# EAGLE design KeyboardController_r3 (EAGLE 7.7.0)

## Sheet 1 of 3
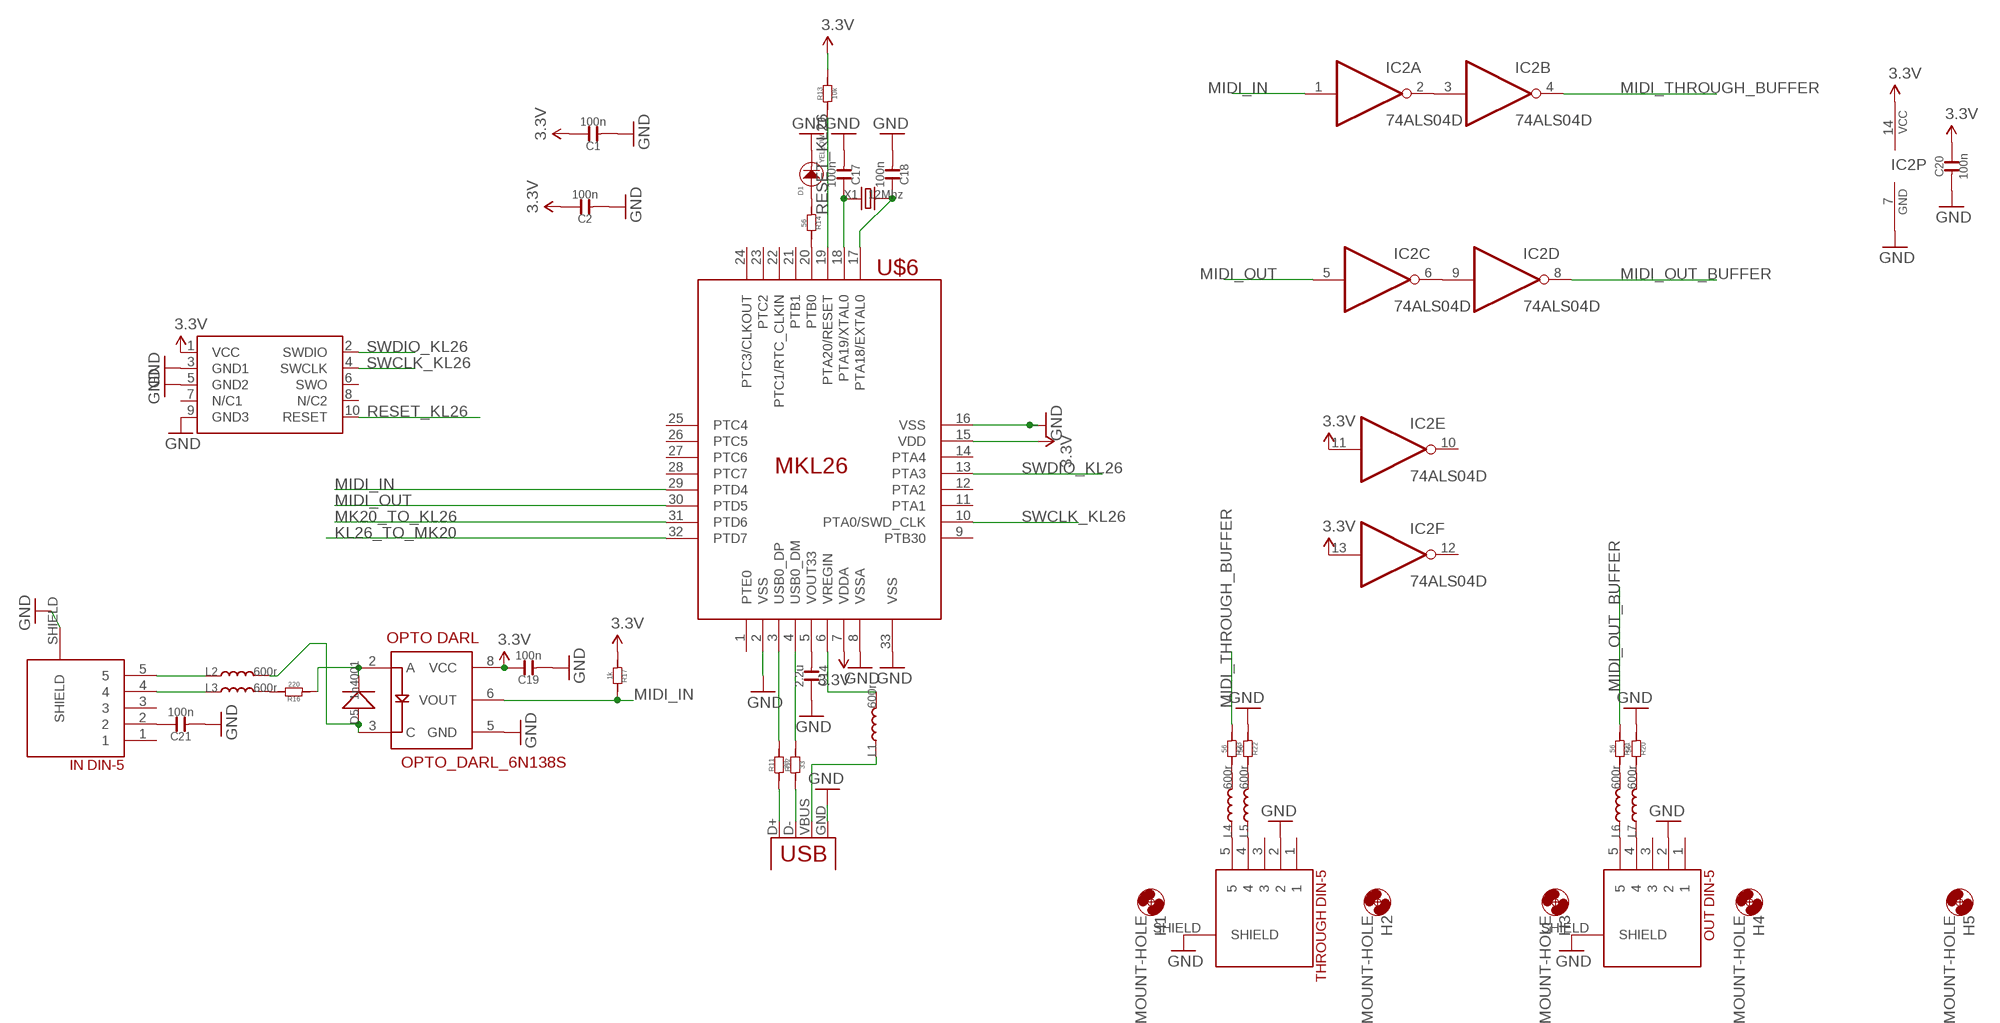
[diagram p0: schematic, sheet 1]

### Parts
C1  100n  C-0603  [C0603]
C2  100n  C-0603  [C0603]
C14  2.2u  C-0603  [C0603]
C17  100n  C-0603  [C0603]
C18  100n  C-0603  [C0603]
C19  100n  C-0603  [C0603]
C20  100n  C-0603  [C0603]
C21  100n  C-0603  [C0603]
D1  YELLOW  LED  [LED0603]
D5  1n4001  D-SOD-123  [SOD123]
H1  MOUNT-HOLE  [3.2-NOMARKINGS-SMALLSAFEZONE]
H2  MOUNT-HOLE  [3.2-NOMARKINGS-SMALLSAFEZONE]
H3  MOUNT-HOLE  [3.2-NOMARKINGS-SMALLSAFEZONE]
H4  MOUNT-HOLE  [3.2-NOMARKINGS-SMALLSAFEZONE]
H5  MOUNT-HOLE  [3.2-NOMARKINGS-SMALLSAFEZONE]
IC2  74ALS04D  [SO14]
IN  DIN-5  [DIN-5-VERTICAL]
L1  600r  L-0603  [L0603]
L2  600r  L-0603  [L0603]
L3  600r  L-0603  [L0603]
L4  600r  L-0603  [L0603]
L5  600r  L-0603  [L0603]
L6  600r  L-0603  [L0603]
L7  600r  L-0603  [L0603]
OUT  DIN-5  [DIN-5-VERTICAL]
R11  33  R-0603  [R0603]
R12  33  R-0603  [R0603]
R13  10k  R-0603  [R0603]
R14  56  R-0603  [R0603]
R16  220  R-0603  [R0603]
R17  1k  R-0603  [R0603]
R20  56  R-0603  [R0603]
R21  56  R-0603  [R0603]
R22  56  R-0603  [R0603]
R23  56  R-0603  [R0603]
SWD2  CORTEX_SWD  [M50-3600542]
THROUGH  DIN-5  [DIN-5-VERTICAL]
U$6  MKL26  [QFN50P500X500X90-33N]
U$9  OPTO_DARL_6N138S  [8-SMD]
USB  USBVERTICAL_CENTERED  [USB-B-PTH-VERTICAL-CENTERED]
X1  12Mhz  CRYSTAL-0500290P1  [2P-SMD-5.0X3.2]

### Nets
3.3V [heavypower]: C1.2 C2.2 C19.2 C20.2 IC2.11(E:I) IC2.13(F:I) IC2.14(P:VCC) R13.2 R17.1 SWD2.1(VCC) U$6.7(VDDA) U$6.15(VDD) U$9.8(VCC) ; also sheet 2,3
GND [groundplane]: C1.1 C2.1 C14.2 C17.1 C18.1 C19.1 C20.1 C21.1 D1.- IC2.7(P:GND) IN.SHIELD OUT.2 OUT.SHIELD R20.1 R22.1 SWD2.3(GND1) SWD2.5(GND2) SWD2.9(GND3) THROUGH.2 THROUGH.SHIELD U$6.2(VSS) U$6.8(VSSA) U$6.16(VSS) U$6.33(VSS) U$9.5(GND) USB.GND ; also sheet 2,3
KL26_TO_MK20: U$6.32(PTD7) ; also sheet 2
MIDI_IN: IC2.1(A:I) R17.2 U$6.29(PTD4) U$9.6(VOUT)
MIDI_OUT: IC2.5(C:I) U$6.30(PTD5)
MIDI_OUT_BUFFER: IC2.8(D:O) R21.1
MIDI_THROUGH_BUFFER: IC2.4(B:O) R23.1
MK20_TO_KL26: U$6.31(PTD6) ; also sheet 2
N$2: R11.2 U$6.3(USB0_DP)
N$3: R12.2 U$6.4(USB0_DM)
N$5: R14.2 U$6.20(PTB0)
N$6: D1.+ R14.1
N$9: C14.1 U$6.5(VOUT33)
N$10: R11.1 USB.D+
N$11: R12.1 USB.D-
N$12: L1.1 USB.VBUS
N$13: L1.2 U$6.6(VREGIN)
N$21: C17.2 U$6.18(PTA19/XTAL0) X1.1
N$26: C18.2 U$6.17(PTA18/EXTAL0) X1.2
N$28: IN.5 L2.1
N$29: IN.4 L3.1
N$30: L4.1 THROUGH.5
N$31: L5.1 THROUGH.4
N$32: L6.1 OUT.5
N$33: L7.1 OUT.4
N$34: D5.- R16.1 U$9.2(A)
N$35: D5.+ L2.2 U$9.3(C)
N$36: L3.2 R16.2
N$37: IC2.2(A:O) IC2.3(B:I)
N$38: IC2.6(C:O) IC2.9(D:I)
N$39: C21.2 IN.2
N$41: L7.2 R20.2
N$42: L6.2 R21.2
N$43: L5.2 R22.2
N$44: L4.2 R23.2
RESET_KL26: R13.1 SWD2.10(RESET) U$6.19(PTA20/RESET)
SWCLK_KL26: SWD2.4(SWCLK) U$6.10(PTA0/SWD_CLK)
SWDIO_KL26: SWD2.2(SWDIO) U$6.13(PTA3)
Unconnected: IC2.10(E:O) IC2.12(F:O) IN.1 IN.3 OUT.1 OUT.3 SWD2.6(SWO) SWD2.7(N/C1) SWD2.8(N/C2) THROUGH.1 THROUGH.3 U$6.1(PTE0) U$6.9(PTB30) U$6.11(PTA1) U$6.12(PTA2) U$6.14(PTA4) U$6.21(PTB1) U$6.22(PTC1/RTC_CLKIN) U$6.23(PTC2) U$6.24(PTC3/CLKOUT) U$6.25(PTC4) U$6.26(PTC5) U$6.27(PTC6) U$6.28(PTC7)

## Sheet 2 of 3
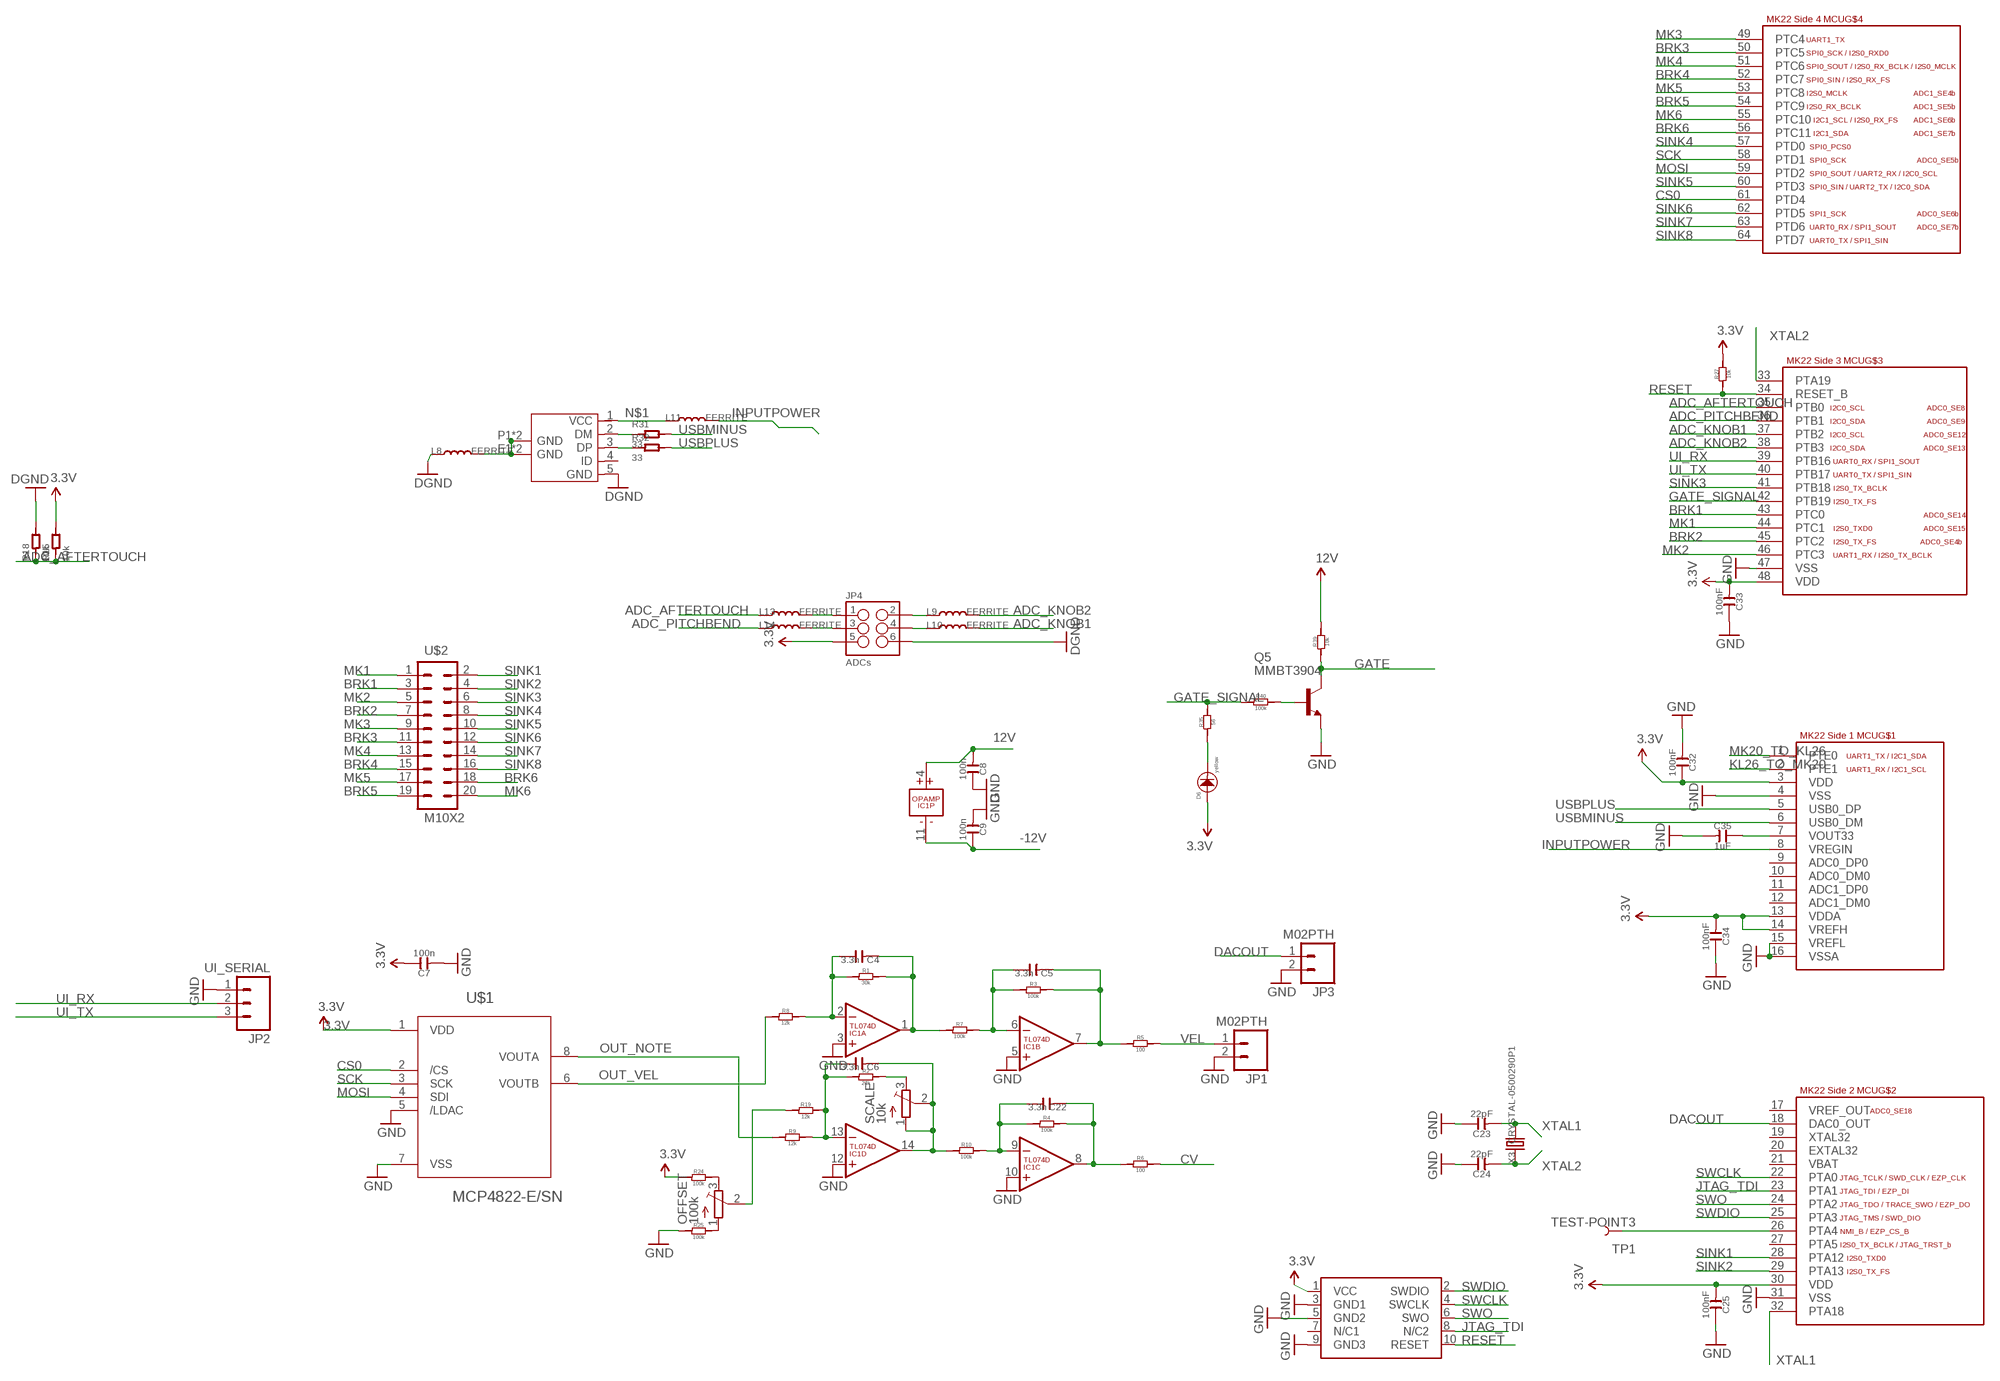
[diagram p1: schematic, sheet 2]

### Parts
C4  3.3n  C-0603  [C0603]
C5  3.3n  C-0603  [C0603]
C6  3.3n  C-0603  [C0603]
C7  100n  C-0603  [C0603]
C8  100n  C-0603  [C0603]
C9  100n  C-0603  [C0603]
C22  3.3n  C-0603  [C0603]
C23  22pF  C-0603  [C0603]
C24  22pF  C-0603  [C0603]
C25  100nF  C-0603  [C0603]
C32  100nF  C-0603  [C0603]
C33  100nF  C-0603  [C0603]
C34  100nF  C-0603  [C0603]
C35  1uF  C-0603  [C0603]
D6  yellow  LED  [LED0603]
IC1  TL074D  [SO14]
J2  MICRO-USB-5P-340015001  [B-SMD-5P]
JP1  M02PTH  [1X02]
JP2  UI_SERIAL  M03PTH  [1X03]
JP3  M02PTH  [1X02]
JP4  ADCs  M03X2  [2X3-SHROUDED]
L8  FERRITE  L-0603  [L0603]
L9  FERRITE  L-0603  [L0603]
L10  FERRITE  L-0603  [L0603]
L11  FERRITE  L-0603  [L0603]
L13  FERRITE  L-0603  [L0603]
L14  FERRITE  L-0603  [L0603]
MCU  MK22_120_TQFP64  [MK22_TQFP64]
OFFSET  100k  TRIMPOTTC33X  [TC33X]
Q5  MMBT3904  MMBT3904LT1-NPN-SOT23-BEC  [SOT23-BEC]
R1  30k  R-0603  [R0603]
R2  24k  R-0603  [R0603]
R3  100k  R-0603  [R0603]
R4  100k  R-0603  [R0603]
R5  100  R-0603  [R0603]
R6  100  R-0603  [R0603]
R7  100k  R-0603  [R0603]
R8  12k  R-0603  [R0603]
R9  12k  R-0603  [R0603]
R10  100k  R-0603  [R0603]
R15  10k  R-0603  [R0603]
R18  10k  R-0603  [R0603]
R19  12k  R-0603  [R0603]
R24  100k  R-0603  [R0603]
R25  100k  R-0603  [R0603]
R27  10k  R-0603  [R0603]
R31  33  R-0603  [R0603]
R32  33  R-0603  [R0603]
R35  56  R-0603  [R0603]
R39  10k  R-0603  [R0603]
R40  100k  R-0603  [R0603]
SCALE  10k  TRIMPOTTC33X  [TC33X]
SWD3  CORTEX_SWD  [M50-3600542]
TP1  TEST-POINT3  [PAD.03X.03]
U$1  MCP4822-E/SN  [SOIC8-N_MC]
U$2  M10X2  [2X10]
X3  CRYSTAL-0500290P1  [2P-SMD-5.0X3.2]

### Nets
3.3V [heavypower]: C7.2 C25.1 C32.2 C33.1 C34.1 D6.+ JP4.5 MCU.3(VDD) MCU.13(VDDA) MCU.14(VREFH) MCU.30(VDD) MCU.48(VDD) R15.2 R24.1 R27.2 SWD3.1(VCC) U$1.1(VDD) ; also sheet 1,3
12V [heavypower]: C8.1 IC1.4(P:V+) R39.2 ; also sheet 3
-12V [heavypower]: C9.2 IC1.11(P:V-) ; also sheet 3
ADC_AFTERTOUCH: L13.1 MCU.35(PTB0) R15.1 R18.1
ADC_KNOB1: L10.2 MCU.37(PTB2)
ADC_KNOB2: L9.2 MCU.38(PTB3)
ADC_PITCHBEND: L14.1 MCU.36(PTB1)
BRK1: MCU.43(PTC0) U$2.3
BRK2: MCU.45(PTC2) U$2.7
BRK3: MCU.50(PTC5) U$2.11
BRK4: MCU.52(PTC7) U$2.15
BRK5: MCU.54(PTC9) U$2.19
BRK6: MCU.56(PTC11) U$2.18
CS0: MCU.61(PTD4) U$1.2(/CS)
CV: R6.2 ; also sheet 3
DACOUT: JP3.1 MCU.18(DAC0_OUT)
GATE: Q5.C R39.1 ; also sheet 3
GATE_SIGNAL: MCU.42(PTB19) R35.2 R40.1
GND [groundplane]: C7.1 C8.2 C9.1 C23.2 C24.2 C25.2 C32.1 C33.2 C34.2 C35.1 IC1.3(A:+IN) IC1.5(B:+IN) IC1.10(C:+IN) IC1.12(D:+IN) J2.5(GND) JP1.2 JP2.1 JP3.2 JP4.6 L8.1 MCU.4(VSS) MCU.15(VREFL) MCU.16(VSSA) MCU.31(VSS) MCU.47(VSS) Q5.E R18.2 R25.1 SWD3.3(GND1) SWD3.5(GND2) SWD3.9(GND3) U$1.5(/LDAC) U$1.7(VSS) ; supply symbol labelled DGND ; also sheet 1,3
INPUTPOWER: L11.2 MCU.8(VREGIN)
JTAG_TDI: MCU.23(PTA1) SWD3.8(N/C2)
KL26_TO_MK20: MCU.2(PTE1) ; also sheet 1
MK1: MCU.44(PTC1) U$2.1
MK2: MCU.46(PTC3) U$2.5
MK3: MCU.49(PTC4) U$2.9
MK4: MCU.51(PTC6) U$2.13
MK5: MCU.53(PTC8) U$2.17
MK6: MCU.55(PTC10) U$2.20
MK20_TO_KL26: MCU.1(PTE0) ; also sheet 1
MOSI: MCU.59(PTD2) U$1.4(SDI)
N$1: J2.1(VCC) L11.1
N$4: R2.2 SCALE.3(E)
N$7: J2.2(DM) R31.1
N$8: J2.3(DP) R32.1
N$14: J2.E1(GND) J2.E2(GND) J2.P1(GND) J2.P2(GND) L8.2
N$17: C4.2 IC1.2(A:-IN) R1.1 R8.2
N$18: C4.1 IC1.1(A:OUT) R1.2 R7.1
N$19: C5.2 IC1.6(B:-IN) R3.1 R7.2
N$20: C5.1 IC1.7(B:OUT) R3.2 R5.1
N$22: C6.2 IC1.13(D:-IN) R2.1 R9.2 R19.2
N$23: C6.1 IC1.14(D:OUT) R10.1 SCALE.1(A) SCALE.2(S)
N$24: C22.2 IC1.9(C:-IN) R4.1 R10.2
N$25: C22.1 IC1.8(C:OUT) R4.2 R6.1
N$27: JP4.2 L9.1
N$45: D6.- R35.1
N$46: OFFSET.2(S) R19.1
N$47: OFFSET.3(E) R24.2
N$48: OFFSET.1(A) R25.2
N$49: JP4.4 L10.1
N$50: JP4.1 L13.2
N$51: JP4.3 L14.2
N$52: C35.2 MCU.7(VOUT33)
N$59: MCU.26(PTA4) TP1.P$1
N$60: Q5.B R40.2
OUT_NOTE: R9.1 U$1.8(VOUTA)
OUT_VEL: R8.1 U$1.6(VOUTB)
RESET: MCU.34(RESET_B) R27.1 SWD3.10(RESET)
SCK: MCU.58(PTD1) U$1.3(SCK)
SINK1: MCU.28(PTA12) U$2.2
SINK2: MCU.29(PTA13) U$2.4
SINK3: MCU.41(PTB18) U$2.6
SINK4: MCU.57(PTD0) U$2.8
SINK5: MCU.60(PTD3) U$2.10
SINK6: MCU.62(PTD5) U$2.12
SINK7: MCU.63(PTD6) U$2.14
SINK8: MCU.64(PTD7) U$2.16
SWCLK: MCU.22(PTA0) SWD3.4(SWCLK)
SWDIO: MCU.25(PTA3) SWD3.2(SWDIO)
SWO: MCU.24(PTA2) SWD3.6(SWO)
UI_RX: JP2.2 MCU.39(PTB16)
UI_TX: JP2.3 MCU.40(PTB17)
USBMINUS: MCU.6(USB0_DM) R31.2
USBPLUS: MCU.5(USB0_DP) R32.2
VEL: JP1.1 R5.2
XTAL1: C23.1 MCU.32(PTA18) X3.2
XTAL2: C24.1 MCU.33(PTA19) X3.1
Unconnected: J2.4(ID) MCU.9(ADC0_DP0) MCU.10(ADC0_DM0) MCU.11(ADC1_DP0) MCU.12(ADC1_DM0) MCU.17(VREF_OUT) MCU.19(XTAL32) MCU.20(EXTAL32) MCU.21(VBAT) MCU.27(PTA5) SWD3.7(N/C1)

## Sheet 3 of 3: Power
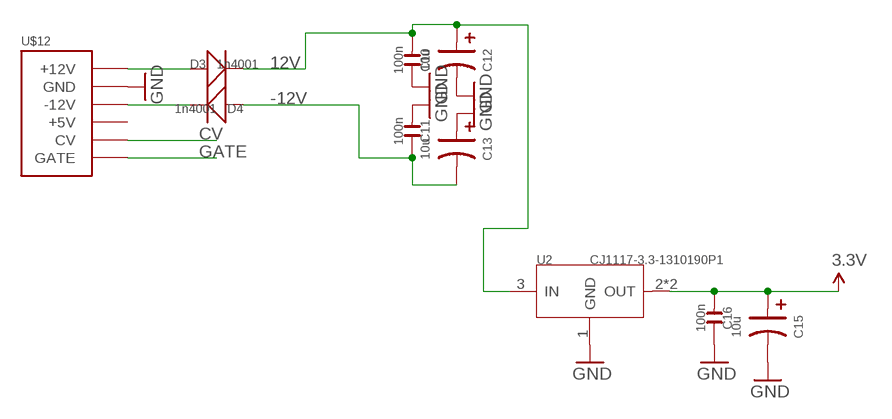
[diagram p2: schematic, sheet 3]

### Parts
C10  100n  C-0603  [C0603]
C11  100n  C-0603  [C0603]
C12  10u  C-POLAR-A  [CASE-A_3216]
C13  10u  C-POLAR-A  [CASE-A_3216]
C15  10u  C-POLAR-A  [CASE-A_3216]
C16  100n  C-0603  [C0603]
D3  1n4001  D-SOD-123  [SOD123]
D4  1n4001  D-SOD-123  [SOD123]
U2  CJ1117-3.3-1310190P1  [SOT223]
U$12  POWER_SHROUDED_NOTEXT  [POWER_16_SHROUDED_NOTEXT]

### Nets
3.3V [heavypower]: C15.+ C16.1 U2.2(OUT) U2.TER(OUT) ; also sheet 1,2
12V [heavypower]: C10.1 C12.+ D3.- U2.3(IN) ; also sheet 2
12VIN [heavypower]: D3.+ U$12.9(+12V) U$12.10(+12V)
-12V [heavypower]: C11.2 C13.- D4.+ ; also sheet 2
-12VIN [heavypower]: D4.- U$12.1(-12V) U$12.2(-12V)
CV: U$12.13(CV) U$12.14(CV) ; also sheet 2
GATE: U$12.15(GATE) U$12.16(GATE) ; also sheet 2
GND [groundplane]: C10.2 C11.1 C12.- C13.+ C15.- C16.2 U2.1(GND) U$12.3(GND) U$12.4(GND) U$12.5(GND) U$12.6(GND) U$12.7(GND) U$12.8(GND) ; also sheet 1,2
Unconnected: U$12.11(+5V) U$12.12(+5V)

## Library data of the parts
C1 C2 C7-C11 C14 C16-C21 C23-C25 C32-C35 = OPL:C*
C4-C6 C22 = OPL Eagle Library:C*
C12 C13 C15 = EurorackModularParts:C-POLAR*
D1 D6 = EurorackModularParts:LED*: LED
D3-D5 = OPL:D*: DIODE
H1-H5 = zephod-components:MOUNT-HOLE: MOUNTING HOLE with drill center marker
IC1 = EurorackModularParts:TL074: OP AMP
IC2 = 74xx-us:74*04: Hex INVERTER
IN OUT THROUGH = EurorackModularParts:DIN-5
J2 = OPL Eagle Library:MICRO-USB-5P: ST-USB-001E：MICRO USB B SMD R/A
JP1 JP3 = SparkFun-Connectors:M02: Standard 2-pin 0.1" header. Use with - straight break away headers ( PRT-00116) - right angle break away headers (PRT-00553) - swiss pins (PRT-00743) - machine pins (PRT-00117) - female headers (PRT-00115) Molex polarized connector foot print use with: PRT-08233 with associated crimp pins and housings. 2.54_SCREWTERM for use with PRT-10571. 3.5mm Screw Terminal footprints for PRT-08084 5mm Screw Terminal footprints for use with PRT-08433
JP2 = SparkFun-Connectors:M03: Header 3 Standard 3-pin 0.1" header. Use with straight break away headers (SKU : PRT-00116), right angle break away headers (PRT-00553), swiss pins (PRT-00743), machine pins (PRT-00117), and female headers (PRT-00115). Molex polarized connector foot print use with SKU : PRT-08232 with associated crimp pins and housings.
JP4 = SparkFun-Connectors:M03X2: 2x3 .1" header. Shrouded, with keying- CONN-10681 SMT- CONN-11415 Pogo pins- HW-11044; PROD_ID: CONN-10681
L1-L7 = OPL:L*
L8-L11 L13 L14 = OPL Eagle Library:L*
MCU = EurorackModularParts:MK22_120_TQFP64
OFFSET SCALE = adafruit:TRIMPOT: SMT trimmer potentiometer part number TC33X http://www.ladyada.net/library/eagle
Q5 = transistor:*-NPN-: NPN Transistror BF959 corrected 2008.03.06; MF: NXP; MPN: PMBT3904,215; OC_FARNELL: 2336795
R1-R14 R16 R17 R19-R25 R27 = OPL:R*
R15 R18 R31 R32 = OPL Eagle Library:R*
R35 R39 R40 = OPL:R*; OC_FARNELL: unknown
SWD2 SWD3 = carrilib with jtags:CORTEX_SWD: .05" Cortex M Connector in SWD mode Manufacturer: Generic Part Number: Cortex M SWD Notes: I use Harwin M50-3600542 connectors
TP1 = SparkFun-Passives:TEST-POINT: Bare copper test points for troubleshooting or ICT
U2 = OPL:CJ1117-3.3: 1A Low Dropout Linear Regulator
U$1 = FarnellThings:MCP4822-E/SN: 12 Bit DAC; DESCRIPTION: 12 Bit DAC; MPN: MCP4822-E/SN; OC_FARNELL: 1439414; OC_NEWARK: 31K2975; PACKAGE: SOIC-8; SUPPLIER: Microchip
U$2 = SparkFun-Connectors:M10X2: This was SPECIALLY designed to be used with our Graphic LCD Backpack. Be sure you want to use this! It is not only staggered on each line of header holes, but IT IS ALSO offset of the center point of the top and bottom lines by 5 mil. This causes the headers to lock into place on the "standard" footprint on the LCD screen. The extra squares on the tdocu layer are there simply to reference other pins (if you were to actually populate a longer header than ten long - this is what we do with the backpacks).
U$6 = EurorackModularParts:MKL26
U$9 = SparkFun-DiscreteSemi:OPTO_DARL_6N138S: Optoisolator, darlington pair output
U$12 = EurorackModularParts:POWER
USB = SparkFun-Connectors:USB: USB Connectors USB-B-PTH is fully proven SKU : PRT-00139/CONN-08278 USB-miniB is fully proven SKU : PRT-00587 USB-A-PCB is untested. USB-A-H is throughly reviewed, but untested. Spark Fun Electronics SKU : PRT-00437 USB-B-SMT is throughly reviewed, but untested. Needs silkscreen touching up. USB-A-S has not been used/tested USB-MB-H has not been used/tested USB-MICROB has been used. CONN-09505
X1 X3 = OPL:CRYSTAL*

## Net classes
0 default: width 0.203 mm
1 heavypower: width 0.203 mm
2 mediumpower: width 0.203 mm
3 groundplane: width 0.203 mm, clearance 0.178 mm

## Board
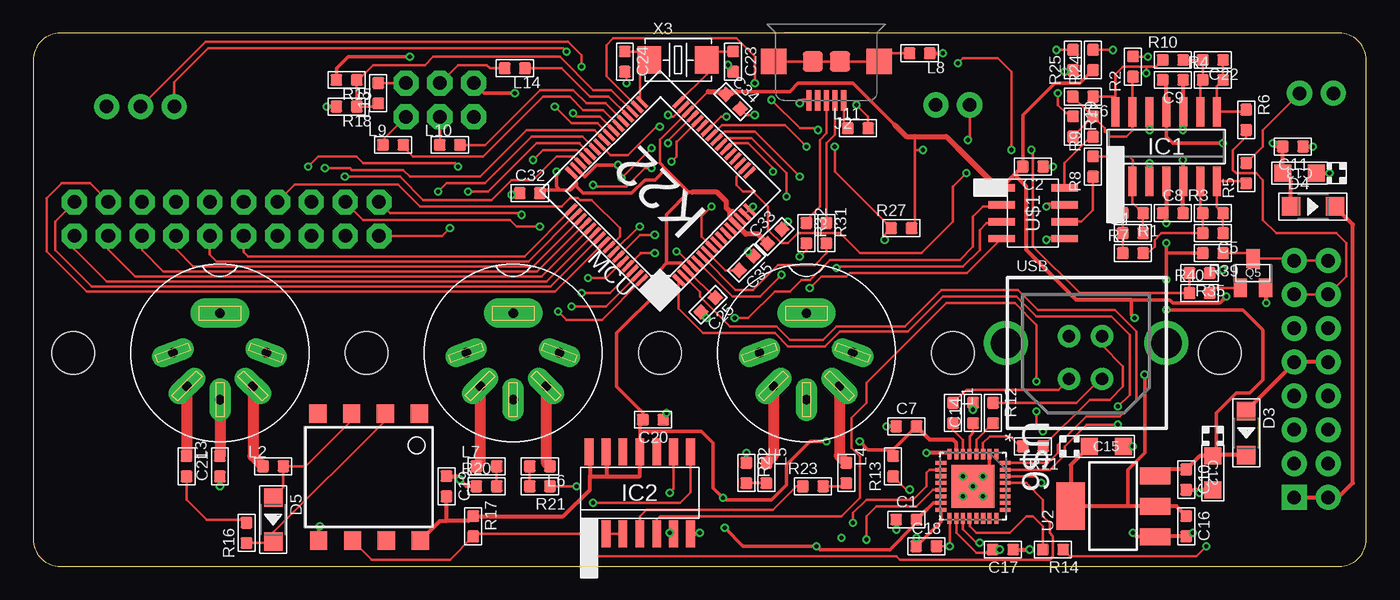
[diagram p3: board, top side]
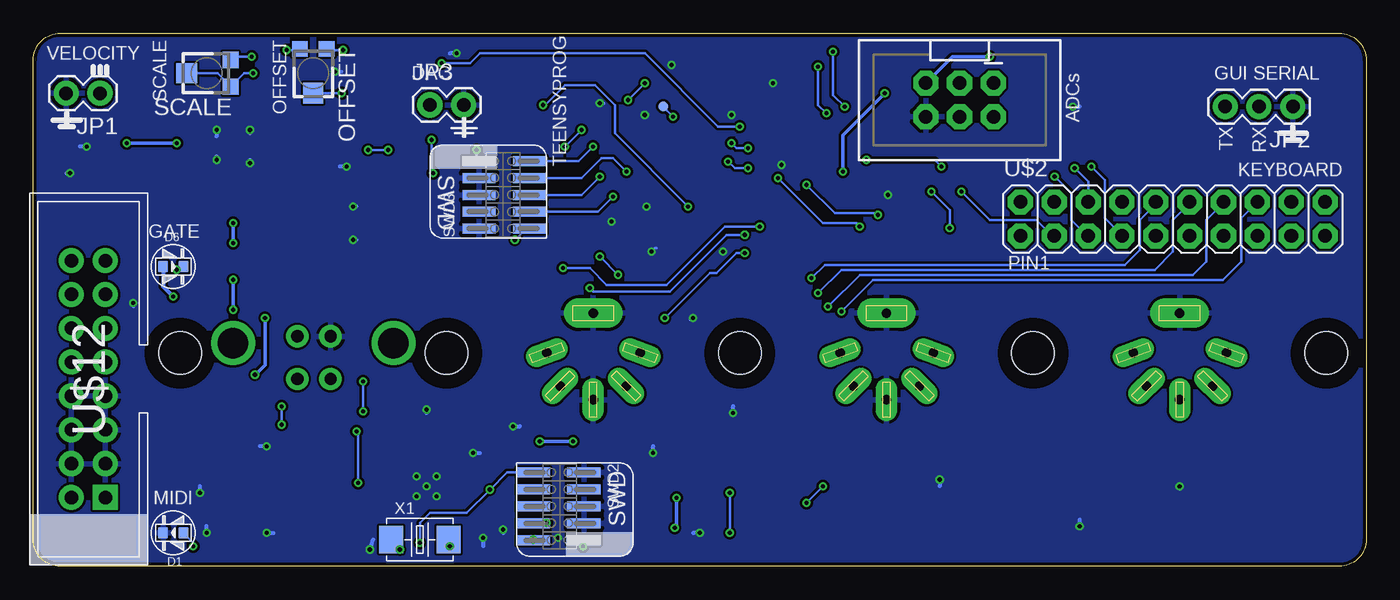
[diagram p4: board, bottom side, seen from below]

Size 100 x 40 mm. Coordinates in mm from the lower left corner, seen from the top.
Outline: 98,40 2,40 arc90 0,38 0,2 arc90 2,0 98,0 arc90 100,2 100,38 arc90 98,40
Copper layers (1*16): Top 0.035mm / dielectric 1.5mm / Bottom 0.035mm
Design rules "dirt_cheap_dirty_boards.v1 *": minimum track width 6mil, minimum drill 12mil, track to track 5mil, track to pad 5mil, pad to pad 5mil, via to via 5mil, smd to smd 0mil, copper to edge 10mil, drill to drill 10mil, minimum pad ring 10mil, minimum via ring 6mil, stop-mask expansion 2mil, vias tented up to drill 25mil, thermal gap 10mil

### Footprints (pad centres in the part's own frame; a part is rotated, then mirrored left to right if it is on the bottom)
C0603 = smd 0.889 x 0.889: 1 -0.762,0; 2 0.762,0
CASE-A_3216 = smd 1.27 x 1.27: + -1.27,0; - 1.27,0
LED0603 = smd 0.762 x 0.889: + -0.762,0; - 0.762,0
SOD123 = smd 1.397 x 1.397: + -1.651,0; - 1.651,0
3.2-NOMARKINGS-SMALLSAFEZONE = hole 3.2: 0,0
SO14 = smd 0.6 x 2.2: 1 -3.81,-2.6; 2 -2.54,-2.6; 3 -1.27,-2.6; 4 0,-2.6; 5 1.27,-2.6; 6 2.54,-2.6; 7 3.81,-2.6; 8 3.81,2.6; 9 2.54,2.6; 10 1.27,2.6; 11 0,2.6; 12 -1.27,2.6; 13 -2.54,2.6; 14 -3.81,2.6
SO14' = smd 0.66 x 2.032: 1 -3.81,-3.073; 2 -2.54,-3.073; 3 -1.27,-3.073; 4 0,-3.073; 5 1.27,-3.073; 6 2.54,-3.073; 7 3.81,-3.073; 8 3.81,3.073; 9 2.54,3.073; 10 1.27,3.073; 11 0,3.073; 12 -1.27,3.073; 13 -2.54,3.073; 14 -3.81,3.073
DIN-5-VERTICAL = drill 0.7 pad 1.6 long: 1 -0.025,-3.525; 2 3.5,0; 3 -0.025,3.475; 4 2.475,-2.475; 5 2.475,2.475 | drill 0.7 pad 2.2 long: SHIELD -3,0
B-SMD-5P = smd 0.38 x 1.52: 1 -1.3,2.54; 2 -0.65,2.54; 3 0,2.54; 4 0.65,2.54; 5 1.3,2.54 | smd 1.524 x 1.524: E1 -1.016,-0.381; E2 1.016,-0.381 | smd 1.9 x 1.9: P1 -3.95,-0.381; P2 3.95,-0.381
1X02 = drill 1.016 pad 1.88: 1 0,0; 2 2.54,0
1X03 = drill 1.016 pad 1.88: 1 0,0; 2 2.54,0; 3 5.08,0
2X3-SHROUDED = drill 1.016 pad 1.88 octagon: 1 -1.27,2.54; 2 1.27,2.54; 3 -1.27,0; 4 1.27,0; 5 -1.27,-2.54; 6 1.27,-2.54
L0603 = smd 0.889 x 0.889: 1 -0.762,0; 2 0.762,0
MK22_TQFP64 = smd 1.1 x 0.285: 1 -5.605,3.385; 2 -5.605,2.885; 3 -5.605,2.385; 4 -5.605,1.885; 5 -5.605,1.385; 6 -5.605,0.885; 7 -5.605,0.385; 8 -5.605,-0.115; 9 -5.605,-0.615; 10 -5.605,-1.115; 11 -5.605,-1.615; 12 -5.605,-2.115; 13 -5.605,-2.615; 14 -5.605,-3.115; 15 -5.605,-3.615; 16 -5.605,-4.115; 33 5.795,-4.115; 34 5.795,-3.615; 35 5.795,-3.115; 36 5.795,-2.615; 37 5.795,-2.115; 38 5.795,-1.615; 39 5.795,-1.115; 40 5.795,-0.615; 41 5.795,-0.115; 42 5.795,0.385; 43 5.795,0.885; 44 5.795,1.385; 45 5.795,1.885; 46 5.795,2.385; 47 5.795,2.885; 48 5.795,3.385 | smd 0.285 x 1.1: 17 -3.655,-6.065; 18 -3.155,-6.065; 19 -2.655,-6.065; 20 -2.155,-6.065; 21 -1.655,-6.065; 22 -1.155,-6.065; 23 -0.655,-6.065; 24 -0.155,-6.065; 25 0.345,-6.065; 26 0.845,-6.065; 27 1.345,-6.065; 28 1.845,-6.065; 29 2.345,-6.065; 30 2.845,-6.065; 31 3.345,-6.065; 32 3.845,-6.065; 49 3.845,5.335; 50 3.345,5.335; 51 2.845,5.335; 52 2.345,5.335; 53 1.845,5.335; 54 1.345,5.335; 55 0.845,5.335; 56 0.345,5.335; 57 -0.155,5.335; 58 -0.655,5.335; 59 -1.155,5.335; 60 -1.655,5.335; 61 -2.155,5.335; 62 -2.655,5.335; 63 -3.155,5.335; 64 -3.655,5.335
TC33X = smd 1.2 x 1.2: 1 -1,-1.825; 3 1,-1.825 | smd 1.5 x 1.6: 2 0,1.5
SOT23-BEC = smd 1 x 1.4: B -0.95,-1.1; C 0,1.1; E 0.95,-1.1
R0603 = smd 0.889 x 0.889: 1 -0.762,0; 2 0.762,0
M50-3600542 = smd 0.75 x 2.5: 1 -2.54,-1.81; 2 -2.54,2; 3 -1.27,-1.81; 4 -1.27,2; 5 0,-1.81; 6 0,2; 7 1.27,-1.81; 8 1.27,2; 9 2.54,-1.81; 10 2.54,2
PAD.03X.03 = smd 0.762 x 0.762: P$1 0,0
SOT223 = smd 1.27 x 2.286: 1 -2.286,-3.175; 2 0,-3.175; 3 2.286,-3.175 | smd 3.556 x 2.159: TER 0,3.175
SOIC8-N_MC = smd 1.981 x 0.559: 1 -2.362,1.905; 2 -2.362,0.635; 3 -2.362,-0.635; 4 -2.362,-1.905; 5 2.362,-1.905; 6 2.362,-0.635; 7 2.362,0.635; 8 2.362,1.905
2X10 = drill 1.016 pad 1.88 octagon: 1 -11.43,-1.27; 2 -11.43,1.27; 3 -8.89,-1.27; 4 -8.89,1.27; 5 -6.35,-1.27; 6 -6.35,1.27; 7 -3.81,-1.27; 8 -3.81,1.27; 9 -1.27,-1.27; 10 -1.27,1.27; 11 1.27,-1.27; 12 1.27,1.27; 13 3.81,-1.27; 14 3.81,1.27; 15 6.35,-1.27; 16 6.35,1.27; 17 8.89,-1.27; 18 8.89,1.27; 19 11.43,-1.27; 20 11.43,1.27
QFN50P500X500X90-33N = smd 0.813 x 0.305: 1 -2.413,1.753; 2 -2.413,1.245; 3 -2.413,0.762; 4 -2.413,0.254; 5 -2.413,-0.254; 6 -2.413,-0.762; 7 -2.413,-1.245; 8 -2.413,-1.753; 17 2.413,-1.753; 18 2.413,-1.245; 19 2.413,-0.762; 20 2.413,-0.254; 21 2.413,0.254; 22 2.413,0.762; 23 2.413,1.245; 24 2.413,1.753 | smd 0.305 x 0.813: 9 -1.753,-2.413; 10 -1.245,-2.413; 11 -0.762,-2.413; 12 -0.254,-2.413; 13 0.254,-2.413; 14 0.762,-2.413; 15 1.245,-2.413; 16 1.753,-2.413; 25 1.753,2.413; 26 1.245,2.413; 27 0.762,2.413; 28 0.254,2.413; 29 -0.254,2.413; 30 -0.762,2.413; 31 -1.245,2.413; 32 -1.753,2.413 | smd 3.2 x 3.2: 33 0,0
8-SMD = smd 1.3 x 1.4: 1 -3.96,-4.96; 2 -1.42,-4.96; 3 1.12,-4.96; 4 3.66,-4.96; 5 3.59,4.58; 6 1.05,4.58; 7 -1.49,4.58; 8 -4.03,4.58
POWER_16_SHROUDED_NOTEXT = drill 1.016 pad 1.88 square: 1 -8.89,-1.27 | drill 1.016 pad 1.88: 2 -8.89,1.27; 3 -6.35,-1.27; 4 -6.35,1.27; 5 -3.81,-1.27; 6 -3.81,1.27; 7 -1.27,-1.27; 8 -1.27,1.27; 9 1.27,-1.27; 10 1.27,1.27; 11 3.81,-1.27; 12 3.81,1.27; 13 6.35,-1.27; 14 6.35,1.27; 15 8.89,-1.27; 16 8.89,1.27
USB-B-PTH-VERTICAL-CENTERED = drill 0.914 pad 1.676: D+ -1.194,-1.257; D- -1.194,1.943; GND 1.295,-1.257; VBUS 1.295,1.943 | drill 2.286: P$1 -6.02,-0.749; P$2 6.02,-0.749
2P-SMD-5.0X3.2 = smd 1.778 x 2.032: 1 -2.159,0; 2 2.159,0

### Placement (x,y rotation side)
C1  65.5,3.5 0 top
C2  75,30 180 top
C4  82.5,25 0 top
C5  88.5,25 180 top
C6  78.75,35.25 180 top
C7  65.5,10.5 0 top
C8  85.5,26.5 0 top
C9  85.5,36.5 180 top
C10  86.5,6.5 270 top
C11  94.5,31.5 180 top
C12  88.5,7 270 top
C13  95,29.5 180 top
C14  70.5,11.5 90 top
C15  80.5,9 0 top
C16  86.5,3 270 top
C17  72.75,1.25 180 top
C18  67,1.5 0 top
C19  31,6 270 top
C20  46.5,11 180 top
C21  14,7.5 90 top
C22  88.5,38 180 top
C23  52.5,37.88 270 top
C24  44.38,37.88 270 top
C25  50.62,19.62 225 top
C32  37.25,28 0 top
C33  55.62,24.75 45 top
C34  52.5,34.88 315 top
C35  53.5,22.75 225 top
D1  89.5,2.5 180 bottom
D3  91,10 270 top
D4  96,27 0 top
D5  18,3.5 270 top
D6  89.5,22.5 0 bottom
H1  25,16 0 top
H2  3,16 0 top
H3  47,16 0 top
H4  69,16 0 top
H5  89,16 0 top
IC1  85,31.5 0 top
IC2  74ALS04D  [SO14']  45.5,5.5 0 top
IN  14,16 270 top
J2  59.5,37.5 180 top
JP1  95,35.5 180 bottom
JP2  5.5,34.5 180 bottom
JP3  70.25,34.62 0 bottom
JP4  30.5,35 270 bottom
L1  69,11.5 270 top
L2  18,7.5 0 top
L3  11.5,7.5 270 top
L4  61,7 270 top
L5  55,7 270 top
L6  38,7.5 180 top
L7  34,7.5 0 top
L8  66.5,38.5 180 top
L9  27,31.62 0 top
L10  31.25,31.62 0 top
L11  61.88,32.88 0 top
L13  25.88,35.5 90 top
L14  36.12,37.38 180 top
MCU  46.85,27.82 135 top
OFFSET  79,37 180 bottom
OUT  36,16 270 top
Q5  91.5,22 0 top
R1  82.5,26.5 180 top
R2  82.5,37.5 90 top
R3  88.5,26.5 0 top
R4  88.5,36.5 0 top
R5  91,29.5 90 top
R6  91,33.5 270 top
R7  82.5,23.5 0 top
R8  79.5,30 90 top
R9  79.5,33 90 top
R10  85.5,38 0 top
R11  75,9 180 top
R12  72,11.5 270 top
R13  64.5,7.5 90 top
R14  76.5,1.25 180 top
R15  23.5,36.5 180 top
R16  16,2.5 90 top
R17  33,3 270 top
R18  23.5,34.5 180 top
R19  78,33 270 top
R20  34,6 0 top
R21  38,6 180 top
R22  53.5,7 270 top
R23  58.5,6 0 top
R24  79.5,38 90 top
R25  78,38 90 top
R27  65.12,25.38 0 top
R31  59.5,25 270 top
R32  58,25 270 top
R35  87.5,22 180 top
R39  88.5,23.5 180 top
R40  87.5,20.5 0 top
SCALE  87,37 90 bottom
SWD2  60.5,4.5 90 bottom
SWD3  64.75,27.88 270 bottom
THROUGH  58,16 270 top
TP1  52.75,34.5 0 bottom
U2  81,4.5 90 top
U$1  75,26.5 0 top
U$2  14.51,26.07 0 bottom
U$6  70.5,6 270 top
U$9  25,6.5 180 top
U$12  95.87,14.05 90 bottom
USB  79,16 180 top
X1  71,2 0 bottom
X3  48.38,38 0 top

### Tracks (layer width: path | path; a pad name or v marks a point on that pad's centre or on a via)
3.3V  (via drill 0.3)
  Top 0.203: 47,30.25 47,32.02 47.03,32.02 MCU.30 50.63,35.62 | 51.14,20.16 MCU.3 49.13,22.2 48.58,22.75 | 40.75,28.75 40.75,29.14 MCU.48 | MCU.14 52.46,26.62 | 52,35.62 52,35.45 C34.1 | 72.34,28.41 U$1.1 | R27.2 66.12,25.61 66.12,31.25 | 66.12,31.25 66.12,32.25 | v66.75,31.25 66.12,31.25 | C32.2 38.26,28.25
  Top 0.279: IC2.11 45.5,10.12 | 45.5,10.12 45.5,10.76 C20.2 45.74,11.51 43.75,13.5 43.75,17.5 47,20.75 47,22.25 47.5,22.75 | 48.58,22.75 47.5,22.75 | 47,30.25 47.44,29.81 | 47.44,29.81 49.17,28.08 | C1.2 66,3.24 66,3 64.25,1.25 59,1.25 v58.75,1.5 53.25,1.5 v51.88,2.88 | R24.1 78.51,36.25 76.62,36.25 74.24,33.86 C2.2 | R13.2 64.5,8.74 | 64.5,8.74 C7.2 | 45.5,10.12 50.12,10.12 51,9.25 51,5.88 v51.75,5.12 51.88,5 55.38,5 56.5,6.12 56.5,7.62 58.25,9.38 v59.5,9.38 | 40.75,28.75 40.75,28.5 41.25,28 44.88,28 45.88,29 46.62,29 47.44,29.81 | 49.17,28.08 47.5,26.41 47.5,22.75 | 49.42,28.08 49.17,28.08 | 40.25,28.25 39.5,28.25 | 39.5,28.25 38.26,28.25 | 39.5,28.25 39.25,28.5 v39.25,29.62 | v36.12,35.5 33.81,35.5 JP4.5 | R15.2 22.74,37.36 23.62,38.25 v28.25,38.25 | v82.62,18.62 82.38,18.88 82.38,20 85.25,20 85.5,19.75 89,19.75 89.25,20 | v83.38,14.38 83.38,8.5 82.12,7.25 82.12,4.62 82,4.5 | 64.5,8.74 62.64,8.74 v62,9.38 | 52.75,35.62 56.75,35.62 57.38,36.25 61.5,36.25 64.62,33.12 | U$6.15 67.52,4.75 67.01,4.25
  Top 0.305: U$6.7 69.25,9.24 69,9.5 67.26,9.5 C7.2 | C15.+ 77.83,7.59 U2.TER 82,4.5 U2.2 85.76,4.5 C16.1 | 31,3.39 C19.2 | 31,3.39 32.63,3.39 R17.1 33.01,3.75 39.75,3.75 41.75,5.75 41.75,6.75 | U$9.8 30.5,3.39 31,3.39 | IC2.14 41.75,8.51 41.75,6.75 | IC2.13 43,8.53 43,6.75 | 41.75,6.75 43,6.75 | 43,6.75 45.5,6.75 IC2.11 | U$1.1 73.62,29.38 | 73.62,29.38 C2.2 | v89.5,20.25 89.25,20 | 82.38,20 78.25,20 74.5,23.75 74.5,28.5 73.62,29.38 | 67.01,4.25 C1.2 | 40.75,28.75 40.25,28.25
  Top 0.381: 52.46,26.62 52.25,26.62 | 52.25,26.62 52.25,26.12 MCU.13 53.46,24.91 54.38,24.91 C33.1 | 52.25,26.62 52,26.88 52,27.38 51.3,28.08 49.42,28.08 | 50.63,35.62 52,35.62 52.75,35.62 | 51.14,20.16 C25.1 | 64.62,33.12 65.5,32.25 66.12,32.25 68.5,32.25 69.39,31.36
  Top 0.4: 69.39,31.36 72.34,28.41
  Bottom 0.203: SWD3.1 66.75,30.61 v66.75,31.25
  Bottom 0.279: v58.75,1.5 58.69,1.31 SWD2.1 | v51.75,5.12 51.75,3 v51.88,2.88 | v39.25,29.62 39.25,32.38 v36.12,35.5 | v28.25,38.25 31.06,38.25 JP4.5 | v82.62,18.62 82.62,15.12 v83.38,14.38 | v62,9.38 v59.5,9.38
  Bottom 0.305: D6.+ 90.26,21.01 v89.5,20.25
12V  (via drill 0.3)
  Top 0.279: 85,26.76 v85,25.75 | 85,23.5 R39.2 | 88.58,8.35 88.75,8.52 88.75,11.5 90.25,13 91.25,13 92.25,14 92.25,17.75 90.75,19.25 v85,19.25 | v85,21.5 85,23.5 | 85,23.5 v85,24.25
  Top 0.305: D3.- 88.58,8.35 C12.+ 87.51,8.27 C10.1 84.65,7.26 U2.3 | IC1.4 85,26.76 C8.1
  Bottom 0.279: v85,25.75 v85,24.25 | v85,19.25 v85,21.5
12VIN
  Top 0.305: U$12.10 U$12.9 94.6,15.25 D3.+
-12V  (via drill 0.3)
  Top 0.279: IC1.11 85,32.25 85.5,31.75 v89.25,31.75 | v93,31.75 93.25,31.5 C11.2
  Top 0.305: D4.+ 94.35,28.88 C13.- C11.2 | IC1.11 85,36.24 C9.2
  Bottom 0.279: v89.25,31.75 v93,31.75
-12VIN
  Top 0.305: U$12.1 U$12.2 97.91,5.16 99,6.25 99,25.65 D4.-
ADC_AFTERTOUCH
  Top 0.203: L13.1 25.64,34.5 R18.1 R15.1 24.38,36.5 25.5,37.62 29.38,37.62 30,38.25 39.5,38.25 42,35.75 43.36,35.75 44.96,34.15 MCU.35
ADC_KNOB1
  Top 0.203: L10.2 33.88,31.62 38,35.75 40.5,35.75 41.5,34.75 42.95,34.75 44.25,33.45 MCU.37
ADC_KNOB2
  Top 0.203: L9.2 27.76,31.49 28.5,30.75 33.75,30.75 38.25,35.25 40.25,35.25 41.25,34.25 42.74,34.25 43.9,33.09 MCU.38
ADC_PITCHBEND
  Top 0.203: L14.1 37.62,37.38 39.62,37.38 41.75,35.25 43.16,35.25 44.6,33.8 MCU.36
BRK1  (via drill 0.3)
  Top 0.203: v30.38,28.12 31,28.75 33.88,28.75 37.38,32.25 41.21,32.25 42.13,31.32 MCU.43
  Bottom 0.203: U$2.3 23.55,24.8 24.75,26 28.25,26 v30.38,28.12
BRK2  (via drill 0.3)
  Top 0.203: v20.62,30 21.38,30.75 24.25,30.75 24.75,30.25 31.62,30.25 v31.88,30 | v37.5,30.5 38.25,31.25 40.79,31.25 41.42,30.62 MCU.45
  Bottom 0.203: U$2.7 18.32,24.82 19.62,26.12 19.62,29 v20.62,30 | 37.62,30.5 v37.5,30.5 32.38,30.5 v31.88,30
BRK3
  Top 0.203: U$2.11 13.24,23.39 13.75,22.88 37.14,22.88 40.69,26.42 MCU.50
BRK4
  Top 0.203: U$2.15 8.16,23.71 9.75,22.12 37.81,22.12 41.39,25.71 MCU.52
BRK5
  Top 0.203: U$2.19 3.08,23.8 5.5,21.38 38,21.38 38.47,21.38 38.5,21.38 MCU.54
BRK6
  Top 0.203: U$2.18 5.67,27.34 4.25,28.75 2.12,28.75 1,27.62 1,23.62 4,20.62 39.14,20.62 42.81,24.3 MCU.56
CS0  (via drill 0.3)
  Top 0.203: U$1.2 72.5,27 71.25,27 70.5,26.25 70.5,24 69.5,23 59.75,23 58.25,21.5 57.62,21.5 56.75,20.62 55.62,20.62 53.62,18.62 v52.62,18.62 | v46.62,23.5 45.55,23.5 45.55,23.47 MCU.61
  Bottom 0.203: v52.62,18.62 49.25,22 48.75,22 47.25,23.5 v46.62,23.5
CV
  Top 0.203: R6.2 91,32.25 90,31.25 90,29.75 90.25,29.5 91.75,29.5 92.25,29 92.25,26 93.25,25 97.75,25 98.5,24.25 98.5,21.76 U$12.14 U$12.13
DACOUT  (via drill 0.3)
  Top 0.203: JP3.1 70.25,32.12 v70.12,32 | v70,29.5 69,28.5 69,25.88 66.62,23.5 62,23.5 60.5,25 57.38,25 56.62,24.25 56.12,24.25 55.12,25.25 55.12,27 54,28.12 53.25,28.12 52.75,28.62 52.75,29.26 MCU.18
  Bottom 0.203: v70.12,32 70.12,29.62 v70,29.5
GATE
  Top 0.203: U$12.16 U$12.15 94.44,23.1 Q5.C 91.1,23.5 R39.1
GATE_SIGNAL  (via drill 0.3)
  Top 0.203: R35.2 R40.1 78.5,20.5 75,24 75,31.12 v74.88,31.25 | v47,33 46.75,33 44.62,30.88 43.29,30.88 42.51,31.65 MCU.42 | v69.38,37.75 69.75,38.12 72.38,38.12 73.38,37.12 v73.38,31.25
  Bottom 0.203: v47,33 48.62,33 54.12,38.5 66.5,38.5 67.25,37.75 v69.38,37.75 | v73.38,31.25 v74.88,31.25
GND  (via drill 0.3)
  Top 0.203: MCU.15 MCU.16 53.96,27 v54,27 | MCU.4 48.39,23.62 v48.25,23.62 | MCU.31 48.05,33.75 47.62,33.75 v47.62,33.88 | C23.2 52.5,37.25 v52.12,37.62 | C32.1 36.36,27.88 v35.88,27.88 | C33.2 56.12,25.33 v56.62,25.88 | C35.1 53.7,23.62 v53.62,23.62 | C24.2 44.5,36.99 v44.5,36.25 | C34.2 53.5,33.88 v54.12,33.88 | C21.1 v14,6 | C25.2 50.09,19.04 v50.5,18.62
  Top 0.279: 71.75,7.25 U$6.2 | R25.1 77.89,37.12 v77.38,37.12 | U$6.16 68.09,3.35 C18.1 | MCU.47 41.35,29.25 41.38,29.25 42.25,30.12 v43.88,30.12
  Top 0.305: U$9.5 21.41,2.41 v21.5,3 | C19.1 31.74,6.76 v32,6.5 32.5,6 R20.1 | C20.1 47.26,11.26 v47.5,11.5 | IC2.7 49.93,2.43 v50,2.5 | R22.1 v53.5,8.5 | C7.1 v64,10.5 | C18.1 v66.25,2.12 | C1.1 64.74,2.76 v64.75,2.75 | C15.- v82.5,9 | v82.5,2.5 82.79,2.21 U2.1 84.2,2.24 C16.2 86.74,2.24 v87,2.5 | C10.2 87.26,5.74 v87.5,5.5 87.73,5.73 C12.- | U$6.33 v71.25,6.75 71.75,7.25 | U$6.8 68.66,8.5 v67,8.5 | C13.+ v97.25,29.5 | C11.1 v96,31.5 | J2.5 57.71,34.96 v57.5,34.75 | C14.2 v70.5,11.75 | C17.1 74.25,1.24 v74.75,1.25 | L8.1 v68.25,38.5 | U$1.5 76.09,24.59 v76,24.5 | U$1.7 76.14,27.14 v76,27 | C2.1 v76.5,30 | C9.1 IC1.10 86.27,32.77 v86.25,32.75 | IC1.12 83.73,32.77 v83.75,32.75 | v86.25,30.5 86.27,30.48 IC1.5 C8.2 | IC1.3 83.73,30.23 v83.75,30.25 | Q5.E 92.45,19.8 v92.5,19.75 | R18.2 v22,34.5
  Bottom 0.203: v56.62,25.88 56.5,25.75 | v53.62,23.62 53.38,23.88 53.25,23.88 | v54,27 54.12,27.12 | v14,6 14,5.75 | v50.5,18.62 50.62,18.62 50.75,18.5
  Bottom 0.279: v77.38,37.12 76.88,37.12
  Bottom 0.305: v21.5,3 21.5,3.5 | v32,6.5 32,6 | v47.5,11.5 47.5,12 | v50,2.5 50.5,2.5 | v53.5,8.5 53.5,9 | v64,10.5 63.5,10.5 | v66.25,2.12 C18.1 | v64.75,2.75 64.75,2.5 | v82.5,9 83,9 | v82.5,2.5 82,2.5 | v87.5,5.5 87.5,6 | v87,2.5 87,3 | v67,8.5 66.5,8.5 | v97.25,29.5 97.5,29.5 | v96,31.5 96.5,31.5 | v57.5,34.75 57.25,34.75 | v70.5,11.75 70.5,11.5 | v74.75,1.25 74.5,2 | v68.25,38.5 68.75,38.5 | v76,24.5 75.75,24.5 | v76,27 75.75,27 | v76.5,30 77,30 | v86.25,32.75 86.25,32.25 | v83.75,32.75 83.75,32.5 | v86.25,30.5 86.25,30.75 | v83.75,30.25 83.75,30.5 | v92.5,19.75 92.5,19.5 | v22,34.5 21.5,34.5
  other vias: 70.5,6 69.75,6.75 69.75,5.25 71.25,5.25 60.62,2.12
  pour Bottom: 0,40 100,40 100,0 0,0
INPUTPOWER  (via drill 0.3)
  Top 0.203: L11.2 62.64,33.74 v61.75,34.62 | v50.88,27 50.12,26.25 50.12,24.75 50.9,23.97 MCU.8
  Bottom 0.203: v61.75,34.62 61.62,34.62 60.12,36.12 57.88,36.12 56.38,34.62 56.38,32.5 v50.88,27
JTAG_TDI  (via drill 0.3)
  Top 0.203: MCU.23 52.08,32.12 53.88,32.12 56.5,29.5 v56.5,27.75
  Bottom 0.203: v56.5,27.75 57.65,26.61 SWD3.8
KL26_TO_MK20
  Top 0.203: U$6.32 76.13,7.75 76.88,8.5 76.88,9.12 79,11.25 81.5,11.25 82.75,12.5 82.75,17.62 81.12,19.25 75.38,19.25 73.88,20.75 68.12,20.75 65.38,18 60.25,18 59.25,17 56.75,17 55.75,18 52.25,18 50,20.25 50,20.6 MCU.2
MIDI_IN
  Top 0.203: U$9.6 25.37,0.5 31.25,0.5 32.99,2.24 R17.2 33.19,2.43 IC2.1 41.69,1.31 42.25,0.75 64.75,0.75 65,0.5 76.25,0.5 76.5,0.75 76.5,2.25 76.25,2.5 76.25,3.25 75.75,3.75 75.75,5 74.5,6.25 U$6.29
MIDI_OUT  (via drill 0.3)
  Top 0.203: IC2.5 46.75,2.45 46.75,3.5 47,3.75 60.62,3.75 62,5.12 62,8.25 61.38,8.88 61.38,11.12 62.5,12.25 62.5,13.75 68.5,19.75 73.62,19.75 75.25,18.12 v75.25,13.88 | v75.25,11.62 75.25,10.62 v75.75,10.12 | U$6.30 73,6.75 75.12,6.75 v75.62,6.25
  Bottom 0.203: v75.25,13.88 v75.25,11.62 | v75.62,6.25 75.62,10 v75.75,10.12
MIDI_OUT_BUFFER  (via drill 0.3)
  Top 0.203: R21.1 v40.75,6 | v42,4.75 48.5,4.75 49.31,5.56 IC2.8
  Bottom 0.203: v40.75,6 v42,4.75
MIDI_THROUGH_BUFFER
  Top 0.203: IC2.4 45.5,3.75 46,4.25 55.5,4.25 57.25,6 R23.1
MK1  (via drill 0.3)
  Top 0.203: U$2.1 30.67,24.8 v31.25,25.38 | v32.62,28.12 34.12,28.12 37.75,31.75 41,31.75 41,31.72 MCU.44
  Bottom 0.203: v31.25,25.38 31.25,26.75 v32.62,28.12
MK2  (via drill 0.3)
  Top 0.203: v23.38,29.25 27.5,29.25 29.25,27.5 34.38,27.5 35.88,29 37.5,29 39.25,30.75 40.58,30.75 40.58,30.72 MCU.46
  Bottom 0.203: U$2.5 20.92,24.8 22.12,26 22.12,28 v23.38,29.25
MK3
  Top 0.203: U$2.9 15.78,23.59 16.12,23.25 36.62,23.25 36.81,23.25 36.84,23.25 MCU.49
MK4
  Top 0.203: U$2.13 10.7,23.8 12,22.5 37.48,22.5 41.04,26.06 MCU.51
MK5
  Top 0.203: U$2.17 5.62,23.75 7.62,21.75 38.14,21.75 41.75,25.36 MCU.53
MK6
  Top 0.203: U$2.20 2.83,27.09 1.62,25.88 1.62,23.75 4.38,21 38.8,21 42.45,24.65 MCU.55
MK20_TO_KL26  (via drill 0.3)
  Top 0.203: v81.38,12 82.25,12.88 82.25,17.38 80.88,18.75 75.25,18.75 73.75,20.25 68.25,20.25 65.62,17.62 60.5,17.62 59.38,16.5 56.62,16.5 55.62,17.5 50.25,17.5 48.42,19.33 MCU.1 | v81.38,10.62 79,10.62 77.38,9 77.38,8.38 76.25,7.25 U$6.31
  Bottom 0.203: v81.38,12 v81.38,10.62
MOSI  (via drill 0.3)
  Top 0.203: U$1.4 70.04,22 61.25,22 61,21.75 59.12,21.75 v58.25,20.88 | v46.62,24.88 45.51,24.88 45.51,24.84 MCU.59
  Bottom 0.203: v46.62,24.88 48,24.88 52.25,20.62 58,20.62 v58.25,20.88
N$1
  Top 0.203: J2.1 60.8,33.19 L11.1
N$2
  Top 0.203: U$6.3 71.25,8.43 71.25,9.25 71.75,9.75 73.25,9.75 74,9 R11.2
N$3
  Top 0.203: U$6.4 70.75,9.5 71.99,10.74 R12.2
N$4  (via drill 0.3)
  Top 0.203: R2.2 83.61,38.26 v83.62,38.25
  Bottom 0.203: v83.62,38.25 84.92,38.25 SCALE.3
N$5
  Top 0.203: R14.2 75.74,3.01 75,3.75 74.5,3.75 73.25,2.5 70.75,2.5 70.25,3 U$6.20
N$6  (via drill 0.3)
  Top 0.203: v88,1.5 87.25,0.75 77.76,0.75 R14.1
  Bottom 0.203: v88,1.5 88,1.76 D1.+
N$7
  Top 0.203: R31.1 59.5,31.75 60.15,32.4 J2.2
N$8
  Top 0.203: R32.1 58,26 59,27 59,32 59.5,32.5 J2.3
N$9
  Top 0.203: U$6.5 70.25,9.75 70.5,10 C14.1
N$10
  Top 0.203: R11.1 79.26,12.5 80.75,12.5 81.75,13.5 81.75,15 80.19,16.56 USB.D+
N$11
  Top 0.203: R12.1 72.01,12.25 78.25,12.25 80.06,14.06 USB.D-
N$12
  Top 0.203: USB.VBUS 76.9,13.25 70,13.25 69.01,12.26 L1.1
N$13
  Top 0.203: U$6.6 69.75,8.43 69.75,9.5 69,10.25 L1.2
N$14
  Top 0.203: J2.P2 J2.E2 J2.E1 J2.P1 64.07,38.5 L8.2
N$17
  Top 0.203: R8.2 82.24,30.76 82.5,30.5 82.5,28.94 IC1.2 82.46,27.3 R1.1 C4.2
N$18
  Top 0.203: IC1.1 81.19,27.05 R1.2 C4.1 R7.1
N$19
  Top 0.203: IC1.6 87.54,26.7 R3.1 C5.2 84.62,25 84.12,24.5 84.12,24 83.62,23.5 R7.2
N$20
  Top 0.203: R5.1 90.84,28.9 IC1.7 88.81,26.95 R3.2 C5.1
N$21  (via drill 0.3)
  Top 0.203: U$6.18 69.25,2.5 70.75,1 71.5,1 71.75,1.25 C17.2 v72.5,1.25
  Bottom 0.203: v72.5,1.25 72.75,2 X1.1
N$22
  Top 0.203: R2.1 82.46,36.2 IC1.13 82.46,32.71 82,32.25 80.75,32.25 80.38,32.62 80.38,32.88 R9.2 | C6.2 78.01,35.25 R9.2 | R9.2 79.5,33.74 R19.2
N$23  (via drill 0.3)
  Top 0.203: IC1.14 81.19,35.12 | 81.19,35.12 81.19,36.94 81.75,37.5 83.5,37.5 | 83.5,37.5 84.24,37.5 R10.1 | v83.5,37 83.5,37.5 | C6.1 81.06,35.25 81.19,35.12
  Bottom 0.203: v83.5,37 84.17,37 SCALE.1 86.17,37 SCALE.2
N$24
  Top 0.203: IC1.9 87.54,36.3 R4.1 87.75,36.51 87.74,36.51 C22.2 R10.2
N$25
  Top 0.203: R6.1 90.84,34.1 IC1.8 88.81,36.05 R4.2 C22.1
N$26  (via drill 0.3)
  Top 0.203: C18.2 v68.75,1.5 U$6.17
  Bottom 0.203: 69,1.5 v68.75,1.5 68.84,1.59 X1.2
N$27
  Top 0.203: JP4.2 26.24,32.01 L9.1
N$28
  Top 0.813: IN.5 16.48,8.26 L2.1
N$29
  Top 0.203: IN.4 11.5,13.53
  Top 0.813: 11.5,13.53 L3.1
N$30
  Top 0.813: THROUGH.5 60.48,8.29 L4.1
N$31
  Top 0.813: THROUGH.4 55.52,8.29 L5.1
N$32
  Top 0.813: OUT.5 38.48,7.79 L6.1
N$33
  Top 0.813: OUT.4 33.52,7.79 L7.1
N$34
  Top 0.203: R16.1 17.89,1.74 D5.- 18,2.54 26.42,10.96 U$9.2
N$35
  Top 0.203: D5.+ 18.76,5.91 L2.2 20.42,7.5 23.88,10.96 U$9.3
N$36
  Top 0.203: L3.2 11.5,5 13,3.5 15.76,3.5 R16.2
N$37
  Top 0.203: IC2.3 IC2.2
N$38  (via drill 0.3)
  Top 0.203: IC2.6 47.97,2.5 v47.75,2.5 | v47.75,5.5 48.04,5.79 IC2.9
  Bottom 0.203: v47.75,2.5 v47.75,5.5
N$39
  Top 0.813: IN.2 C21.2
N$41
  Top 0.203: L7.2 R20.2
N$42
  Top 0.203: L6.2 R21.2
N$43
  Top 0.203: R22.2 53.75,6.25 L5.2
N$44
  Top 0.203: R23.2 60.76,6 L4.2
N$45  (via drill 0.3)
  Top 0.203: R35.1 89,22 v89.25,22.25
  Bottom 0.203: v89.25,22.25 88.99,22.25 D6.-
N$46  (via drill 0.3)
  Top 0.203: R19.1 77.75,34.01 77.49,34.01 76.88,34.62 v76.88,35.5
  Bottom 0.203: OFFSET.2 v76.88,35.5
N$47  (via drill 0.3)
  Top 0.203: R24.2 80.99,38.76 v81,38.75
  Bottom 0.203: v81,38.75 80.08,38.75 OFFSET.3
N$48  (via drill 0.3)
  Top 0.203: R25.2 76.76,38.76 v76.75,38.75
  Bottom 0.203: v76.75,38.75 77.92,38.75 OFFSET.1
N$49
  Top 0.203: L10.1 30.5,31.64 JP4.4
N$50
  Top 0.203: JP4.1 L13.2
N$51
  Top 0.203: L14.2 34.25,37.38 34,37.62 31.86,37.62 JP4.3
N$52
  Top 0.203: MCU.7 51.92,22.21 C35.2
N$59  (via drill 0.3)
  Top 0.203: v52,33.75 51.59,33.75 MCU.26
  Bottom 0.203: TP1.P$1 52.5,34.25 v52,33.75
N$60
  Top 0.203: Q5.B 88.36,20.9 R40.2
OUT_NOTE
  Top 0.203: U$1.8 77.36,30.25 79.35,32.24 R9.1
OUT_VEL
  Top 0.203: U$1.6 78.61,25.86 79.5,26.75 R8.1
RESET  (via drill 0.3)
  Top 0.203: v58.88,32.75 58.75,32.88 57.5,32.88 v55.38,35 | v54.12,36.25 54.12,38.25 52.75,39.62 43.5,39.62 43,39.12 43,36.79 MCU.34 | v63.88,24.5 63.88,24.89 R27.1 60.12,29.61 v60.12,31.5
  Bottom 0.203: v60.12,31.5 v58.88,32.75 | v54.12,36.25 v55.38,35 | v63.88,24.5 63.04,25.34 SWD3.10
RESET_KL26  (via drill 0.3)
  Top 0.203: U$6.19 69.74,2.76 70.75,1.75 v71,1.75 | v65.75,5.75 65.49,5.75 R13.1
  Bottom 0.203: v71,1.75 71,3.25 70.25,4 67.5,4 v65.75,5.75 64.46,7.04 SWD2.10
SCK  (via drill 0.3)
  Top 0.203: U$1.3 72.52,25.75 71.5,25.75 71,25.25 71,23.75 69.75,22.5 60.38,22.5 v60.25,22.38 | v45.5,25.5 45.43,25.5 43.54,23.62 MCU.58
  Bottom 0.203: v45.5,25.5 48.12,25.5 52.5,21.12 57,21.12 58.25,22.38 v60.25,22.38
SINK1  (via drill 0.3)
  Top 0.203: v47.88,30.38 48.25,30.75 48.25,31.86 48.28,31.86 MCU.28 | v46.38,29.88 45.88,29.88 44.5,28.5 42.12,28.5 v42,28.62 | v36.62,26.38 36.5,26.5 26.77,26.5 U$2.2
  Bottom 0.203: v47.88,30.38 47.38,29.88 v46.38,29.88 | v42,28.62 39.88,26.5 36.75,26.5 v36.62,26.38
SINK2  (via drill 0.3)
  Top 0.203: U$2.4 24.73,26 35.75,26 36.25,25.5 v38,25.5 | v47.62,31.75 47.62,31.94 49.45,33.77 MCU.29 | v46.38,31.38 v44.12,29.12
  Bottom 0.203: v47.62,31.75 47.25,31.38 v46.38,31.38 | v44.12,29.12 40.75,25.75 38.25,25.75 v38,25.5
SINK3  (via drill 0.3)
  Top 0.203: v21.88,29.88 23.75,29.88 23.88,29.75 27.75,29.75 28.25,29.25 33.5,29.25 37,32.75 42.12,32.75 42.12,32.72 MCU.41
  Bottom 0.203: U$2.6 20.86,28.86 v21.88,29.88
SINK4
  Top 0.203: MCU.57 44,24.75 44,25.38 41.88,27.5 41,27.5 40.88,27.62 40.25,27.62 39.62,27 29,27 27.37,28.63 19.62,28.63 U$2.8 | MCU.57
SINK5  (via drill 0.3)
  Top 0.203: v41.62,21.62 42.97,21.62 44.22,22.88 MCU.60
  Bottom 0.203: U$2.10 15.78,27.22 17,26 17,23.75 18.12,22.62 40.62,22.62 v41.62,21.62
SINK6  (via drill 0.3)
  Top 0.203: v41.12,20.5 43.26,20.5 44.93,22.17 MCU.62
  Bottom 0.203: U$2.12 13.24,27.26 14.5,26 14.5,23.62 15.88,22.25 39.38,22.25 v41.12,20.5
SINK7  (via drill 0.3)
  Top 0.203: v40.38,19.5 42.96,19.5 45.28,21.82 MCU.63
  Bottom 0.203: U$2.14 10.7,27.3 12,26 12,22.88 13,21.88 38,21.88 v40.38,19.5
SINK8  (via drill 0.3)
  Top 0.203: v39.38,19.12 40,18.5 42.67,18.5 45.63,21.47 MCU.64
  Bottom 0.203: U$2.16 9.38,26.12 9.38,22.88 10.75,21.5 37,21.5 v39.38,19.12
SWCLK  (via drill 0.3)
  Top 0.203: MCU.22 52.41,31.75 53.62,31.75 55.5,29.88 v55.5,29.62
  Bottom 0.203: SWD3.4 62.73,29.12 58.88,29.12 57.38,30.62 56.5,30.62 v55.5,29.62
SWCLK_KL26  (via drill 0.3)
  Top 0.203: U$6.10 67.25,7.25 67,7 67,6 66,5 62.5,5 61.5,4 v61.5,3.25
  Bottom 0.203: SWD2.4 62.48,3.25 v61.5,3.25
SWDIO  (via drill 0.3)
  Top 0.203: MCU.25 51.67,33.12 56.38,33.12 v58,31.5
  Bottom 0.203: SWD3.2 59.09,30.41 v58,31.5
SWDIO_KL26  (via drill 0.3)
  Top 0.203: U$6.13 67.5,5.75 66.25,4.5 63.25,4.5 62.5,3.75 v62.5,2
  Bottom 0.203: v62.5,2 SWD2.2
SWO  (via drill 0.3)
  Top 0.203: MCU.24 51.88,32.62 54.12,32.62 v57.5,29.25
  Bottom 0.203: v57.5,29.25 58.88,27.88 SWD3.6
UI_RX  (via drill 0.3)
  Top 0.203: JP2.2 12.91,39.38 40.12,39.38 41.12,38.38 v41.12,37.5 | v40.5,34 40.75,33.75 42.53,33.75 43.54,32.74 MCU.39
  Bottom 0.203: v41.12,37.5 41.12,34.62 v40.5,34
UI_TX  (via drill 0.3)
  Top 0.203: JP2.3 10.58,36.33 13.12,38.88 39.75,38.88 v40,38.62 | v39.12,34.5 40.38,33.25 42.33,33.25 43.19,32.39 MCU.40
  Bottom 0.203: v40,38.62 40,35.38 v39.12,34.5
USBMINUS
  Top 0.203: R31.2 59.5,23.5 58.62,22.62 55.88,22.62 54,20.75 52.67,20.75 MCU.6
USBPLUS  (via drill 0.3)
  Top 0.203: v56.12,21.88 54.5,20.25 52.47,20.25 MCU.5 | v57.5,23.25 58,23.75 R32.2
  Bottom 0.203: v56.12,21.88 v57.5,23.25
VEL
  Top 0.203: R5.2 91.01,30.26 92.25,31.5 92.25,32.75 JP1.1
XTAL1
  Top 0.203: MCU.32 50.53,36.94 X3.2 51.3,38.64 C23.1
XTAL2
  Top 0.203: MCU.33 45.5,35 45.5,37.25 46.22,37.97 X3.1 45.58,38.64 C24.1

### Text on the board
bPlace: OFFSET | SCALE | GUI SERIAL | VELOCITY | ADCs | DAC | RX | TX | TEENSYPROG | KEYBOARD | GATE | PIN1 | MIDI